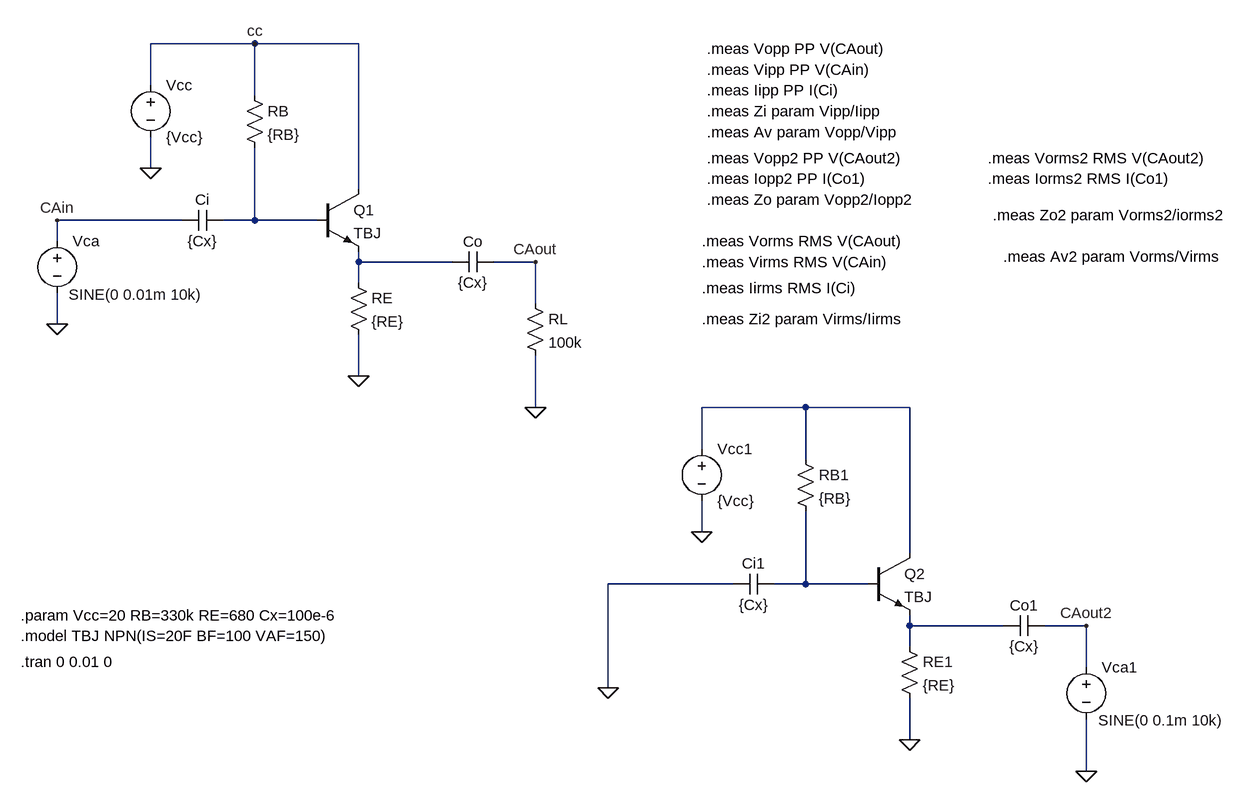
[diagram p0: schematic TBJ03CA.asc]
TBJ03CA.asc, the LTspice schematic file:
Version 4
SHEET 1 1652 1200
WIRE 128 -16 -32 -16
WIRE 288 -16 128 -16
WIRE -32 48 -32 -16
WIRE 128 64 128 -16
WIRE -32 176 -32 128
WIRE 288 208 288 -16
WIRE 16 256 -176 256
WIRE 128 256 128 144
WIRE 128 256 80 256
WIRE 224 256 128 256
WIRE -176 288 -176 256
WIRE 288 320 288 304
WIRE 432 320 288 320
WIRE 560 320 496 320
WIRE 288 352 288 320
WIRE 560 384 560 320
WIRE -176 416 -176 368
WIRE 288 496 288 432
WIRE 560 544 560 464
WIRE 976 544 816 544
WIRE 1136 544 976 544
WIRE 816 608 816 544
WIRE 976 624 976 544
WIRE 816 736 816 688
WIRE 1136 768 1136 544
WIRE 864 816 672 816
WIRE 976 816 976 704
WIRE 976 816 928 816
WIRE 1072 816 976 816
WIRE 1136 880 1136 864
WIRE 1280 880 1136 880
WIRE 1408 880 1344 880
WIRE 1136 912 1136 880
WIRE 1408 944 1408 880
WIRE 672 976 672 816
WIRE 1136 1056 1136 992
WIRE 1408 1104 1408 1024
FLAG -32 176 0
FLAG 288 496 0
FLAG -176 416 0
FLAG 128 -16 cc
FLAG -176 256 CAin
FLAG 560 544 0
FLAG 560 320 CAout
FLAG 816 736 0
FLAG 1136 1056 0
FLAG 672 976 0
FLAG 1408 1104 0
FLAG 1408 880 CAout2
SYMBOL res 112 48 R0
SYMATTR InstName RB
SYMATTR Value {RB}
SYMBOL voltage -32 32 R0
WINDOW 123 0 0 Left 0
WINDOW 39 0 0 Left 0
SYMATTR InstName Vcc
SYMATTR Value {Vcc}
SYMBOL npn 224 208 R0
SYMATTR InstName Q1
SYMATTR Value TBJ
SYMBOL cap 80 240 R90
WINDOW 0 0 32 VBottom 2
WINDOW 3 32 32 VTop 2
SYMATTR InstName Ci
SYMATTR Value {Cx}
SYMBOL cap 496 304 R90
WINDOW 0 0 32 VBottom 2
WINDOW 3 32 32 VTop 2
SYMATTR InstName Co
SYMATTR Value {Cx}
SYMBOL voltage -176 272 R0
WINDOW 123 0 0 Left 0
WINDOW 39 0 0 Left 0
WINDOW 3 18 98 Left 2
SYMATTR Value SINE(0 0.01m 10k)
SYMATTR InstName Vca
SYMBOL res 544 368 R0
SYMATTR InstName RL
SYMATTR Value 100k
SYMBOL res 272 336 R0
SYMATTR InstName RE
SYMATTR Value {RE}
SYMBOL res 960 608 R0
SYMATTR InstName RB1
SYMATTR Value {RB}
SYMBOL voltage 816 592 R0
WINDOW 123 0 0 Left 0
WINDOW 39 0 0 Left 0
SYMATTR InstName Vcc1
SYMATTR Value {Vcc}
SYMBOL npn 1072 768 R0
SYMATTR InstName Q2
SYMATTR Value TBJ
SYMBOL cap 928 800 R90
WINDOW 0 0 32 VBottom 2
WINDOW 3 32 32 VTop 2
SYMATTR InstName Ci1
SYMATTR Value {Cx}
SYMBOL cap 1344 864 R90
WINDOW 0 0 32 VBottom 2
WINDOW 3 32 32 VTop 2
SYMATTR InstName Co1
SYMATTR Value {Cx}
SYMBOL voltage 1408 928 R0
WINDOW 123 0 0 Left 0
WINDOW 39 0 0 Left 0
WINDOW 3 18 98 Left 2
SYMATTR Value SINE(0 0.1m 10k)
SYMATTR InstName Vca1
SYMBOL res 1120 896 R0
SYMATTR InstName RE1
SYMATTR Value {RE}
TEXT 824 24 Left 2 !.meas Vipp PP V(CAin)
TEXT 824 56 Left 2 !.meas Iipp PP I(Ci)
TEXT 824 88 Left 2 !.meas Zi param Vipp/Iipp
TEXT 824 -8 Left 2 !.meas Vopp PP V(CAout)
TEXT 824 120 Left 2 !.meas Av param Vopp/Vipp
TEXT 824 160 Left 2 !.meas Vopp2 PP V(CAout2)
TEXT 824 192 Left 2 !.meas Iopp2 PP I(Co1)
TEXT 824 224 Left 2 !.meas Zo param Vopp2/Iopp2
TEXT -232 936 Left 2 !.tran 0 0.01 0
TEXT -232 864 Left 2 !.param Vcc=20 RB=330k RE=680 Cx=100e-6
TEXT -232 896 Left 2 !.model TBJ NPN(IS=20F BF=100 VAF=150)
TEXT 816 288 Left 2 !.meas Vorms RMS V(CAout)
TEXT 816 320 Left 2 !.meas Virms RMS V(CAin)
TEXT 816 360 Left 2 !.meas Iirms RMS I(Ci)
TEXT 816 408 Left 2 !.meas Zi2 param Virms/Iirms
TEXT 1256 160 Left 2 !.meas Vorms2 RMS V(CAout2)
TEXT 1256 192 Left 2 !.meas Iorms2 RMS I(Co1)
TEXT 1264 248 Left 2 !.meas Zo2 param Vorms2/iorms2
TEXT 1280 312 Left 2 !.meas Av2 param Vorms/Virms

The netlist it stands for:
* TBJ03CA.asc
RB cc N001 {RB}
Vcc cc 0 {Vcc}
Q1 cc N001 N002 0 TBJ
Ci N001 CAin {Cx}
Co CAout N002 {Cx}
Vca CAin 0 SINE(0 0.01m 10k)
RL CAout 0 100k
RE N002 0 {RE}
RB1 N003 N004 {RB}
Vcc1 N003 0 {Vcc}
Q2 N003 N004 N005 0 TBJ
Ci1 N004 0 {Cx}
Co1 CAout2 N005 {Cx}
Vca1 CAout2 0 SINE(0 0.1m 10k)
RE1 N005 0 {RE}
.model NPN NPN
.model PNP PNP
.lib standard.bjt
.meas Vipp PP V(CAin)
.meas Iipp PP I(Ci)
.meas Zi param Vipp/Iipp
.meas Vopp PP V(CAout)
.meas Av param Vopp/Vipp
.meas Vopp2 PP V(CAout2)
.meas Iopp2 PP I(Co1)
.meas Zo param Vopp2/Iopp2
.tran 0 0.01 0
.param Vcc=20 RB=330k RE=680 Cx=100e-6
.model TBJ NPN(IS=20F BF=100 VAF=150)
.meas Vorms RMS V(CAout)
.meas Virms RMS V(CAin)
.meas Iirms RMS I(Ci)
.meas Zi2 param Virms/Iirms
.meas Vorms2 RMS V(CAout2)
.meas Iorms2 RMS I(Co1)
.meas Zo2 param Vorms2/iorms2
.meas Av2 param Vorms/Virms
.backanno
.end